# EAGLE design PBPJ1_CP (EAGLE 5.11)
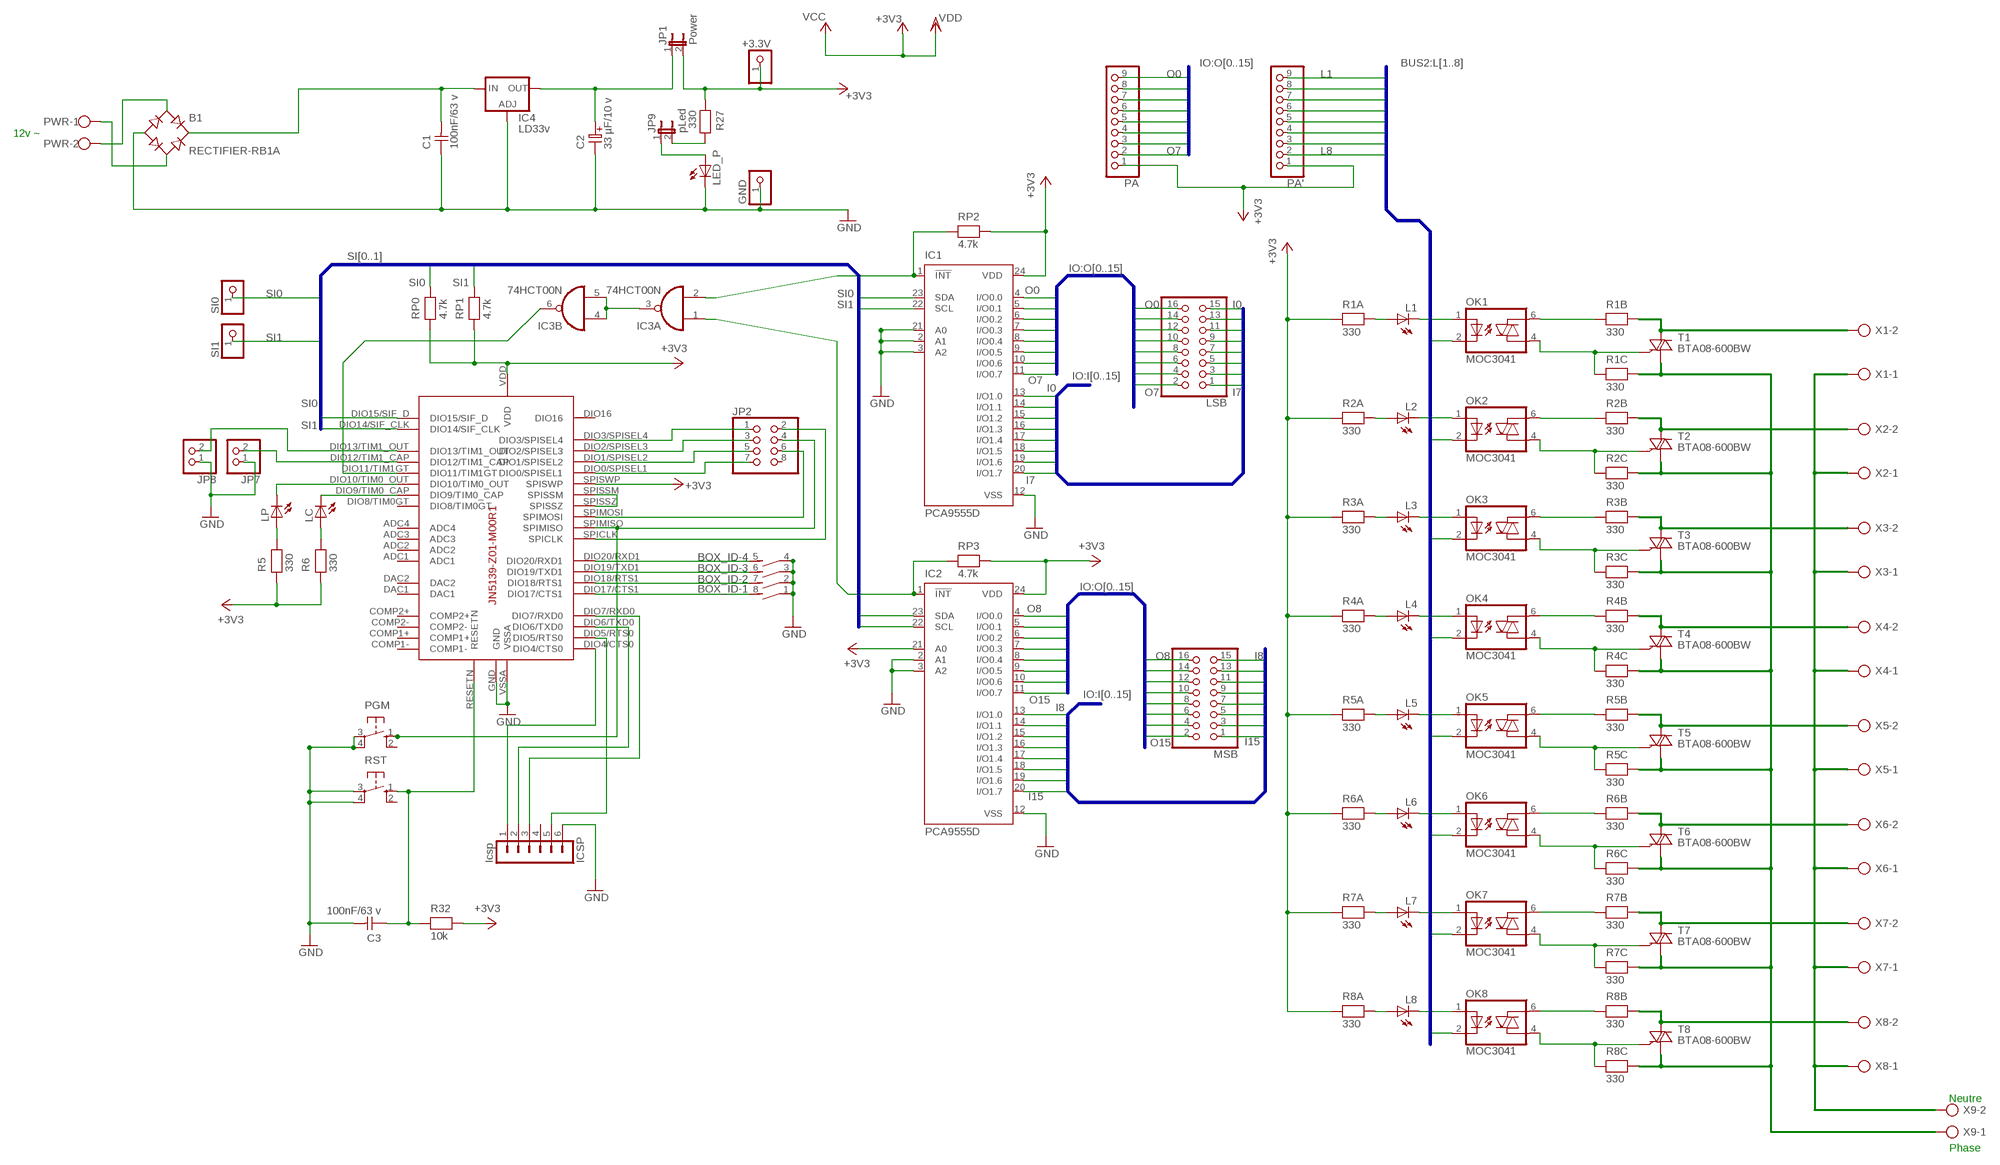
[diagram p0: schematic, sheet 1]

## Parts
+3.3V  PINHD-1X1  [1X01]
B1  RECTIFIER-RB1A  [RB1A]
BOX_ID  DIP04S  [DIP04S]
C1  100nF/63 v  CAPNP-5  [C-5]
C2  33 µF/10 v  ELC-2,5L  [ES-2,5L]
C3  100nF/63 v  CAPNP-5  [C-5]
GND  PINHD-1X1  [1X01]
IC1  PCA9555D  [SO24]
IC2  PCA9555D  [SO24]
IC3  74HCT00N  [DIL14]
IC4  LD33v  LM317TS  [317TS]
ICSP  Icsp  MA06-1  [MA06-1]
JP1  Power  JP1E  [JP1]
JP2  PINHD-2X4  [2X04]
JP7  PINHD-1X2  [1X02]
JP8  PINHD-1X2  [1X02]
JP9  pLed  JP1E  [JP1]
L1  LED3MM  [LED3MM]
L2  LED3MM  [LED3MM]
L3  LED3MM  [LED3MM]
L4  LED3MM  [LED3MM]
L5  LED3MM  [LED3MM]
L6  LED3MM  [LED3MM]
L7  LED3MM  [LED3MM]
L8  LED3MM  [LED3MM]
LC  LED3MM  [LED3MM]
LED_P  LED3MM  [LED3MM]
LP  LED3MM  [LED3MM]
LSB  PINHD-2X8  [2X08]
MSB  PINHD-2X8  [2X08]
OK1  MOC3041  IL420  [DIL06]
OK2  MOC3041  IL420  [DIL06]
OK3  MOC3041  IL420  [DIL06]
OK4  MOC3041  IL420  [DIL06]
OK5  MOC3041  IL420  [DIL06]
OK6  MOC3041  IL420  [DIL06]
OK7  MOC3041  IL420  [DIL06]
OK8  MOC3041  IL420  [DIL06]
PA  PINHD-1X9  [1X09]
PA'  PINHD-1X9  [1X09]
PGM  10-XX  [B3F-10XX]
PWR  AK550/2  [AK550/2]
R1A  330  RESEU-7,5  [R-7,5]
R1B  330  RESEU-7,5  [R-7,5]
R1C  330  RESEU-7,5  [R-7,5]
R2A  330  RESEU-7,5  [R-7,5]
R2B  330  RESEU-7,5  [R-7,5]
R2C  330  RESEU-7,5  [R-7,5]
R3A  330  RESEU-7,5  [R-7,5]
R3B  330  RESEU-7,5  [R-7,5]
R3C  330  RESEU-7,5  [R-7,5]
R4A  330  RESEU-7,5  [R-7,5]
R4B  330  RESEU-7,5  [R-7,5]
R4C  330  RESEU-7,5  [R-7,5]
R5  330  RESEU-7,5  [R-7,5]
R5A  330  RESEU-7,5  [R-7,5]
R5B  330  RESEU-7,5  [R-7,5]
R5C  330  RESEU-7,5  [R-7,5]
R6  330  RESEU-7,5  [R-7,5]
R6A  330  RESEU-7,5  [R-7,5]
R6B  330  RESEU-7,5  [R-7,5]
R6C  330  RESEU-7,5  [R-7,5]
R7A  330  RESEU-7,5  [R-7,5]
R7B  330  RESEU-7,5  [R-7,5]
R7C  330  RESEU-7,5  [R-7,5]
R8A  330  RESEU-7,5  [R-7,5]
R8B  330  RESEU-7,5  [R-7,5]
R8C  330  RESEU-7,5  [R-7,5]
R27  330  RESEU-7,5  [R-7,5]
R32  10k  RESEU-7,5  [R-7,5]
RP0  4.7k  RESEU-7,5  [R-7,5]
RP1  4.7k  RESEU-7,5  [R-7,5]
RP2  4.7k  RESEU-7,5  [R-7,5]
RP3  4.7k  RESEU-7,5  [R-7,5]
RST  10-XX  [B3F-10XX]
SI0  PINHD-1X1  [1X01]
SI1  PINHD-1X1  [1X01]
T1  BTA08-600BW  TIC225S  [TO220DS]
T2  BTA08-600BW  TIC225S  [TO220DS]
T3  BTA08-600BW  TIC225S  [TO220DS]
T4  BTA08-600BW  TIC225S  [TO220DS]
T5  BTA08-600BW  TIC225S  [TO220DS]
T6  BTA08-600BW  TIC225S  [TO220DS]
T7  BTA08-600BW  TIC225S  [TO220DS]
T8  BTA08-600BW  TIC225S  [TO220DS]
U1  JN5139-Z01-M00R1  [JENNIC5139MODULE]
X1  AK500/2  [AK500/2]
X2  AK500/2  [AK500/2]
X3  AK500/2  [AK500/2]
X4  AK500/2  [AK500/2]
X5  AK500/2  [AK500/2]
X6  AK500/2  [AK500/2]
X7  AK500/2  [AK500/2]
X8  AK500/2  [AK500/2]
X9  AK500/2  [AK500/2]

## Nets
+3V3: +3.3V.1 IC1.24(VDD) IC2.21(A0) IC2.24(VDD) JP1.2 PA'.1 PA.1 R1A.1 R2A.1 R3A.1 R4A.1 R5.1 R5A.1 R6.1 R6A.1 R7A.1 R8A.1 R27.1 R32.2 RP0.1 RP1.1 RP2.2 RP3.2 U1.SPISWP U1.VDD ; supply symbol labelled VDD, VCC
GND: B1.- BOX_ID.1 BOX_ID.2 BOX_ID.3 BOX_ID.4 C1.1 C2.2 C3.2 GND.1 IC1.2(A1) IC1.3(A2) IC1.12(VSS) IC1.21(A0) IC2.2(A1) IC2.3(A2) IC2.12(VSS) IC4.1(ADJ) ICSP.6 JP7.1 JP8.1 LED_P.K(C) PGM.3(P) PGM.4(P1) RST.3(P) RST.4(P1) U1.GND U1.VSSA
I0: IC1.13(I/O1.0) LSB.15
I1: IC1.14(I/O1.1) LSB.13
I2: IC1.15(I/O1.2) LSB.11
I3: IC1.16(I/O1.3) LSB.9
I4: IC1.17(I/O1.4) LSB.7
I5: IC1.18(I/O1.5) LSB.5
I6: IC1.19(I/O1.6) LSB.3
I7: IC1.20(I/O1.7) LSB.1
I8: IC2.13(I/O1.0) MSB.15
I9: IC2.14(I/O1.1) MSB.13
I10: IC2.15(I/O1.2) MSB.11
I11: IC2.16(I/O1.3) MSB.9
I12: IC2.17(I/O1.4) MSB.7
I13: IC2.18(I/O1.5) MSB.5
I14: IC2.19(I/O1.6) MSB.3
I15: IC2.20(I/O1.7) MSB.1
L1: OK1.2(C) PA'.9
L2: OK2.2(C) PA'.8
L3: OK3.2(C) PA'.7
L4: OK4.2(C) PA'.6
L5: OK5.2(C) PA'.5
L6: OK6.2(C) PA'.4
L7: OK7.2(C) PA'.3
L8: OK8.2(C) PA'.2
N$1: L4.K(C) OK4.1(A)
N$2: C2.1 IC4.2(OUT) JP1.1
N$3: B1.+ C1.2 IC4.3(IN)
N$4: B1.AC1 PWR.2
N$5: B1.AC2 PWR.1
N$6: OK2.4(A1) R2C.1 T2.G
N$7: C3.1 R32.1 RST.1(S) U1.RESETN
N$8: OK1.4(A1) R1C.1 T1.G
N$9: L3.K(C) OK3.1(A)
N$10: OK3.4(A1) R3C.1 T3.G
N$11: U1.SPISSM U1.SPISSZ
N$12: OK4.4(A1) R4C.1 T4.G
N$13: L1.K(C) OK1.1(A)
N$14: JP2.1 U1.DIO3/SPISEL4
N$15: OK5.4(A1) R5C.1 T5.G
N$16: JP2.3 U1.DIO2/SPISEL3
N$17: L2.K(C) OK2.1(A)
N$18: OK6.4(A1) R6C.1 T6.G
N$19: JP2.5 U1.DIO1/SPISEL2
N$20: JP2.7 U1.DIO0/SPISEL1
N$21: OK7.4(A1) R7C.1 T7.G
N$22: L5.K(C) OK5.1(A)
N$23: JP2.6 U1.SPIMOSI
N$24: OK8.4(A1) R8C.1 T8.G
N$25: OK1.6(A2) R1B.1
N$26: OK2.6(A2) R2B.1
N$27: L6.K(C) OK6.1(A)
N$28: JP2.2 U1.SPICLK
N$30: OK3.6(A2) R3B.1
N$31: OK4.6(A2) R4B.1
N$32: L7.K(C) OK7.1(A)
N$33: OK5.6(A2) R5B.1
N$34: OK6.6(A2) R6B.1
N$35: OK7.6(A2) R7B.1
N$36: OK8.6(A2) R8B.1
N$37: L8.K(C) OK8.1(A)
N$45: IC3.3(A:O) IC3.4(B:I0) IC3.5(B:I1)
N$46: IC1.1(!INT) IC3.2(A:I1) RP2.1
N$47: JP9.2 R27.2
N$48: IC2.1(!INT) IC3.1(A:I0) RP3.1
N$49: IC3.6(B:O) U1.DIO11/TIM1GT
N$53: L2.A R2A.2
N$54: L3.A R3A.2
N$55: L4.A R4A.2
N$56: L5.A R5A.2
N$57: L6.A R6A.2
N$58: L7.A R7A.2
N$59: L8.A R8A.2
N$60: L1.A R1A.2
N$62: BOX_ID.5 U1.DIO20/RXD1
N$65: JP9.1 LED_P.A
N$67: ICSP.2 U1.DIO6/TXD0
N$70: JP2.4 PGM.1(S) U1.SPIMISO
N$73: ICSP.1 U1.DIO4/CTS0
N$74: ICSP.5 U1.DIO5/RTS0
N$77: ICSP.3 U1.DIO7/RXD0
N$78 [AC_VOLTAGE]: R1B.2 T1.A2 X1.2
N$79 [AC_VOLTAGE]: R2B.2 T2.A2 X2.2
N$80 [AC_VOLTAGE]: R3B.2 T3.A2 X3.2
N$81 [AC_VOLTAGE]: R4B.2 T4.A2 X4.2
N$82 [AC_VOLTAGE]: R5B.2 T5.A2 X5.2
N$83 [AC_VOLTAGE]: R6B.2 T6.A2 X6.2
N$84: R7B.2 T7.A2 X7.2
N$92: BOX_ID.6 U1.DIO19/TXD1
N$93: R8B.2 T8.A2 X8.2
N$94: BOX_ID.7 U1.DIO18/RTS1
N$95: BOX_ID.8 U1.DIO17/CTS1
N$96: JP7.2 U1.DIO12/TIM1_CAP
N$97: LP.A R5.2
N$98: JP8.2 U1.DIO13/TIM1_OUT
N$100: LP.K(C) U1.DIO10/TIM0_OUT
N$101: LC.A R6.2
N$103: LC.K(C) U1.DIO9/TIM0_CAP
NEUTRE [AC_VOLTAGE]: X1.1 X2.1 X3.1 X4.1 X5.1 X6.1 X7.1 X8.1 X9.2
O0: IC1.4(I/O0.0) LSB.16 PA.9
O1: IC1.5(I/O0.1) LSB.14 PA.8
O2: IC1.6(I/O0.2) LSB.12 PA.7
O3: IC1.7(I/O0.3) LSB.10 PA.6
O4: IC1.8(I/O0.4) LSB.8 PA.5
O5: IC1.9(I/O0.5) LSB.6 PA.4
O6: IC1.10(I/O0.6) LSB.4 PA.3
O7: IC1.11(I/O0.7) LSB.2 PA.2
O8: IC2.4(I/O0.0) MSB.16
O9: IC2.5(I/O0.1) MSB.14
O10: IC2.6(I/O0.2) MSB.12
O11: IC2.7(I/O0.3) MSB.10
O12: IC2.8(I/O0.4) MSB.8
O13: IC2.9(I/O0.5) MSB.6
O14: IC2.10(I/O0.6) MSB.4
O15: IC2.11(I/O0.7) MSB.2
PHASE [AC_VOLTAGE]: R1C.2 R2C.2 R3C.2 R4C.2 R5C.2 R6C.2 R7C.2 R8C.2 T1.A1 T2.A1 T3.A1 T4.A1 T5.A1 T6.A1 T7.A1 T8.A1 X9.1
SI0: IC1.23(SDA) IC2.23(SDA) RP0.2 SI0.1 U1.DIO15/SIF_D
SI1: IC1.22(SCL) IC2.22(SCL) RP1.2 SI1.1 U1.DIO14/SIF_CLK
Unconnected: IC3.8(C:O) IC3.9(C:I0) IC3.10(C:I1) IC3.11(D:O) IC3.12(D:I0) IC3.13(D:I1) ICSP.4 JP2.8 PGM.2(S1) RST.2(S1) U1.ADC1 U1.ADC2 U1.ADC3 U1.ADC4 U1.COMP1+ U1.COMP1- U1.COMP2+ U1.COMP2- U1.DAC1 U1.DAC2 U1.DIO8/TIM0GT U1.DIO16

## Buses
SI[0..1]
BUS2:L[1..8]
IO:I[0..15]
IO:O[0..15]

## Notes on the sheet
- 12v ~
- Neutre
- Phase

## Power pins joined to a net without a drawn wire
GND: IC3.7(P:GND)
VCC: IC3.14(P:VCC)

## Library data of the parts
+3.3V GND SI0 SI1 = pinhead:PINHD-1X1: PIN HEADER
B1 = rectifier:RECTIFIER-: Rectifier
BOX_ID = switch-dil:DIP04S: DIL/CODE SWITCH; OC_FARNELL: unknown; OC_NEWARK: unknown
C1 C3 = discrete:CAPNP-5
C2 = discrete:ELC-2,5L
IC1 IC2 = micro-philips:PCA9555: 16-bit I2C and SMBus I/O port with interrupt Source: PCA9555_5.pdf; MPN: PCA9555DW; OC_FARNELL: 1408295; OC_NEWARK: 63K6067
IC3 = 74xx-eu:74*00: Quad 2-input NAND gate
IC4 = v-reg:LM317TS: VOLTAGE REGULATOR
ICSP = con-lstb:MA06-1: PIN HEADER; OC_FARNELL: unknown; OC_NEWARK: unknown
JP1 JP9 = jumper:JP1E: JUMPER
JP2 = pinhead:PINHD-2X4: PIN HEADER
JP7 JP8 = pinhead:PINHD-1X2: PIN HEADER
L1-L8 LC LED_P LP = led:LED: LED OSRAM: - CHIPLED LG R971, LG N971, LY N971, LG Q971, LY Q971, LO R971, LY R971 LH N974, LH R974 LS Q976, LO Q976, LY Q976 LO Q996 - Hyper CHIPLED LW Q18S LB Q993, LB Q99A, LB R99A - SideLED LS A670, LO A670, LY A670, LG A670, LP A670 LB A673, LV A673, LT A673, LW A673 LH A674 LY A675 LS A676, LA A676, LO A676, LY A676, LW A676 LS A679, LY A679, LG A679 - Hyper Micro SIDELED® LS Y876, LA Y876, LO Y876, LY Y876 LT Y87S - SmartLED LW L88C, LW L88S LB L89C, LB L89S, LG L890 LS L89K, LO L89K, LY L89K LS L896, LA L896, LO L896, LY L896 - TOPLED LS T670, LO T670, LY T670, LG T670, LP T670 LSG T670, LSP T670, LSY T670, LOP T670, LYG T670 LG T671, LOG T671, LSG T671 LB T673, LV T673, LT T673, LW T673 LH T674 LS T676, LA T676, LO T676, LY T676, LB T676, LH T676, LSB T676, LW T676 LB T67C, LV T67C, LT T67C, LS T67K, LO T67K, LY T67K, LW E67C LS E67B, LA E67B, LO E67B, LY E67B, LB E67C, LV E67C, LT E67C LW T67C LS T679, LY T679, LG T679 LS T770, LO T770, LY T770, LG T770, LP T770 LB T773, LV T773, LT T773, LW T773 LH T774 LS E675, LA E675, LY E675, LS T675 LS T776, LA T776, LO T776, LY T776, LB T776 LHGB T686 LT T68C, LB T68C - Hyper Mini TOPLED® LB M676 - Mini TOPLED Santana® LG M470 LS M47K, LO M47K, LY M47K Source: http://www.osram.convergy.de LUXEON: - LUMILED® LXK2-PW12-R00, LXK2-PW12-S00, LXK2-PW14-U00, LXK2-PW14-V00 LXK2-PM12-R00, LXK2-PM12-S00, LXK2-PM14-U00 LXK2-PE12-Q00, LXK2-PE12-R00, LXK2-PE12-S00, LXK2-PE14-T00, LXK2-PE14-U00 LXK2-PB12-K00, LXK2-PB12-L00, LXK2-PB12-M00, LXK2-PB14-N00, LXK2-PB14-P00, LXK2-PB14-Q00 LXK2-PR12-L00, LXK2-PR12-M00, LXK2-PR14-Q00, LXK2-PR14-R00 LXK2-PD12-Q00, LXK2-PD12-R00, LXK2-PD12-S00 LXK2-PH12-R00, LXK2-PH12-S00 LXK2-PL12-P00, LXK2-PL12-Q00, LXK2-PL12-R00 Source: www.luxeon.com KINGBRIGHT: KA-3528ASYC Source: www.kingbright.com
LSB MSB = pinhead:PINHD-2X8: PIN HEADER
OK1-OK8 = optocoupler:IL420: SIEMENS OPTO COUPLER
PA PA' = pinhead:PINHD-1X9: PIN HEADER
PGM RST = switch-omron:10-XX: OMRON SWITCH; MPN: B3F-1000; OC_FARNELL: 176432; OC_NEWARK: 36M3542
PWR = con-ptr500+:AK550/2: CONNECTOR
R1A R1B R1C R2A R2B R2C R3A R3B R3C R4A R4B R4C R5 R5A R5B R5C R6 R6A R6B R6C R7A R7B R7C R8A R8B R8C R27 R32 RP0 RP1-RP3 = discrete:RESEU-7,5
T1-T8 = triac:TIC225S: TRIAC
U1 = jennic:JN5139-Z01-M00R1: Jennic 5139 Zigbee Module
X1-X9 = con-ptr500:AK500/2: CONNECTOR; OC_FARNELL: unknown; OC_NEWARK: unknown

## Net classes
0 default: width 0.254 mm, drill 0.6 mm, clearance 0.254 mm
1 AC_VOLTAGE: width 0.254 mm, drill 0.6 mm, clearance 0.254 mm
2 AC_TERRE: width 1.422 mm, clearance 0.254 mm

## Board
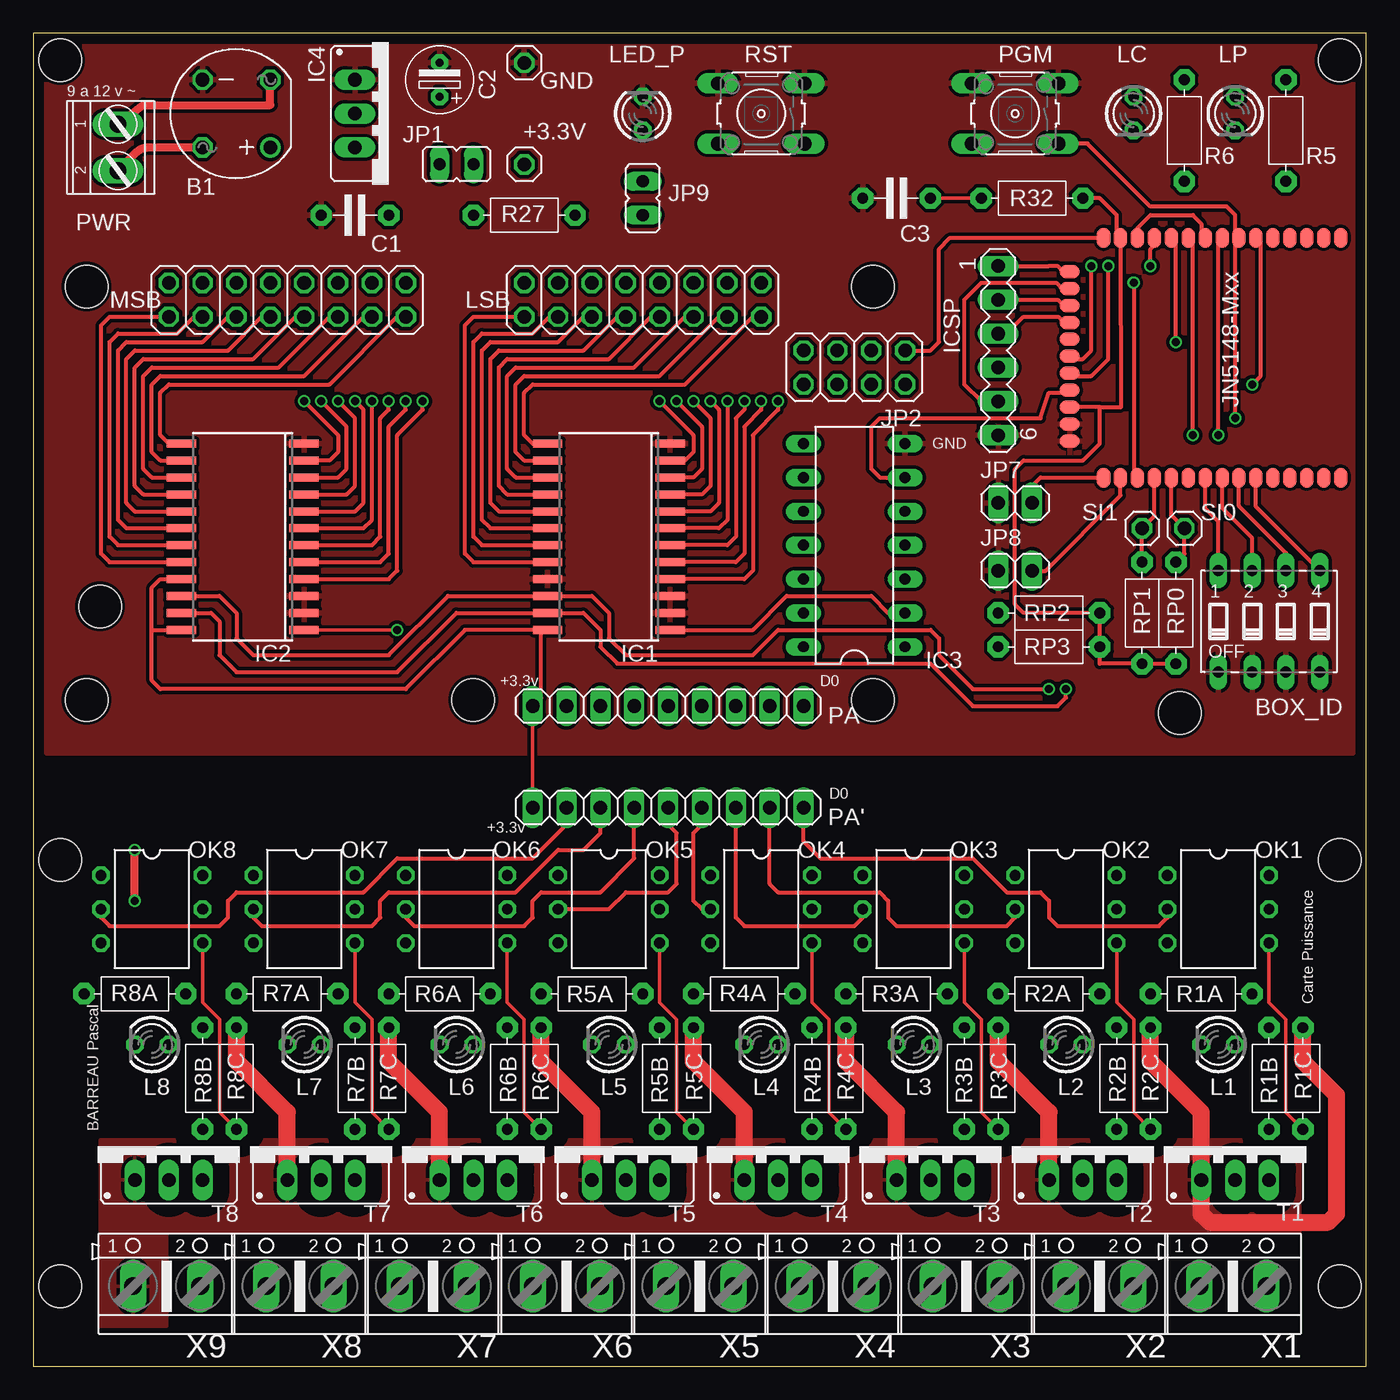
[diagram p1: board, top side]
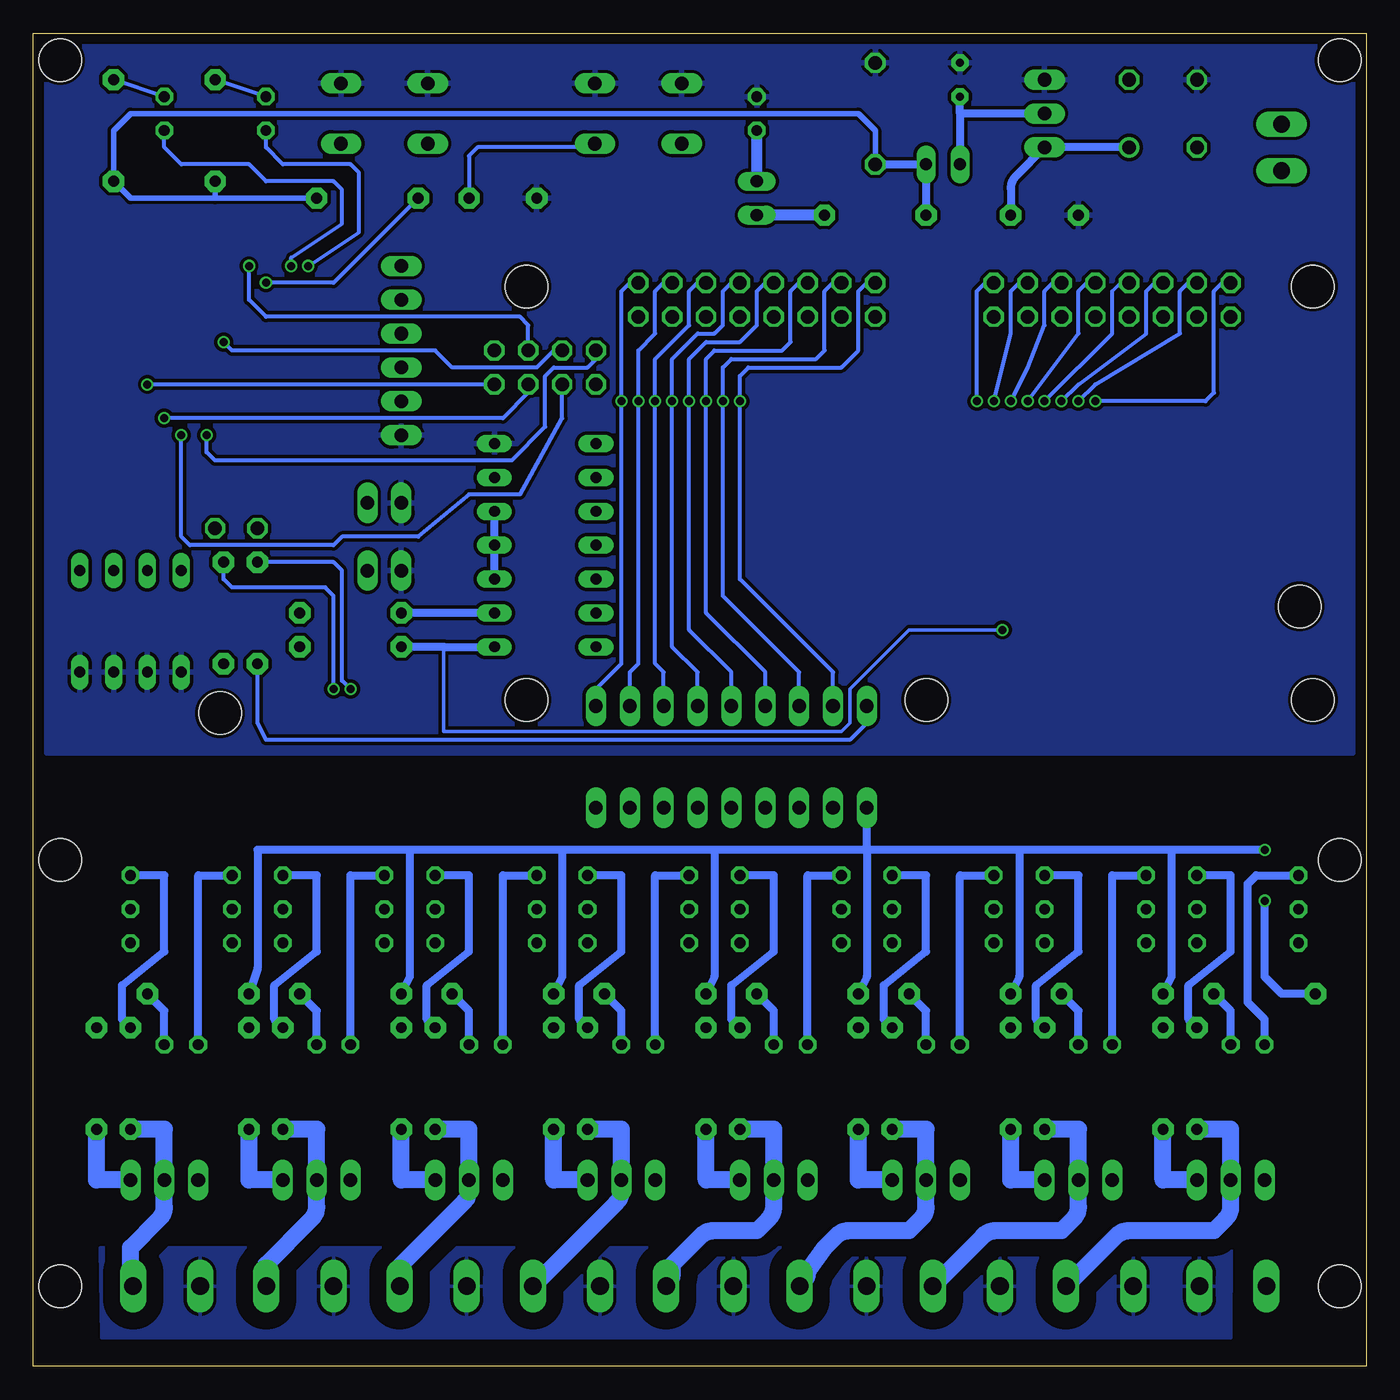
[diagram p2: board, bottom side, seen from below]

Size 100 x 100 mm. Coordinates in mm from the lower left corner, seen from the top.
Outline: 0,0 100,0 100,100 0,100 0,0
Copper layers (1*16): Top 0.035mm / dielectric 1.5mm / Bottom 0.035mm
Design rules "ElecFreaks_CAM_DRC_V1.0": minimum track width 6mil, minimum drill 12mil, track to track 6mil, track to pad 6mil, pad to pad 6mil, via to via 6mil, smd to smd 0mil, copper to edge 10mil, drill to drill 10mil, minimum pad ring 10mil, minimum via ring 6mil, stop-mask expansion 2mil, vias tented up to drill 100mil, thermal gap 10mil
Holes 3.2 mm at 63,50 86,49 4,50 98,6 2,6 2,98 98,98 4,81 63,81 98,38 2,38 5,57 33,50

### Footprints (pad centres in the part's own frame; a part is rotated, then mirrored left to right if it is on the bottom)
1X01 = drill 1.016 octagon: 1 0,0
RB1A = drill 1.016 round: + -2.54,2.54 | drill 1.016 octagon: - 2.54,-2.54; AC1 2.54,2.54; AC2 -2.54,-2.54
DIP04S = drill 0.813 long: 1 -3.81,-3.81; 2 -1.27,-3.81; 3 1.27,-3.81; 4 3.81,-3.81; 5 3.81,3.81; 6 1.27,3.81; 7 -1.27,3.81; 8 -3.81,3.81
C-5 = drill 0.813 pad 1.6 octagon: 1 -2.54,0; 2 2.54,0
ES-2,5L = drill 0.61 pad 1.27 octagon: 1 0,0; 2 2.54,0
SO24 = smd 0.6 x 2.2: 1 -6.985,-4.6; 2 -5.715,-4.6; 3 -4.445,-4.6; 4 -3.175,-4.6; 5 -1.905,-4.6; 6 -0.635,-4.6; 7 0.635,-4.6; 8 1.905,-4.6; 9 3.175,-4.6; 10 4.445,-4.6; 11 5.715,-4.6; 12 6.985,-4.6; 13 6.985,4.6; 14 5.715,4.6; 15 4.445,4.6; 16 3.175,4.6; 17 1.905,4.6; 18 0.635,4.6; 19 -0.635,4.6; 20 -1.905,4.6; 21 -3.175,4.6; 22 -4.445,4.6; 23 -5.715,4.6; 24 -6.985,4.6
DIL14 = drill 0.813 long: 1 -7.62,-3.81; 2 -5.08,-3.81; 3 -2.54,-3.81; 4 0,-3.81; 5 2.54,-3.81; 6 5.08,-3.81; 7 7.62,-3.81; 8 7.62,3.81; 9 5.08,3.81; 10 2.54,3.81; 11 0,3.81; 12 -2.54,3.81; 13 -5.08,3.81; 14 -7.62,3.81
317TS = drill 1.016 long: 1 -2.54,-2.54; 2 0,-2.54; 3 2.54,-2.54
MA06-1 = drill 1.016 long: 1 -6.35,0; 2 -3.81,0; 3 -1.27,0; 4 1.27,0; 5 3.81,0; 6 6.35,0
JP1 = drill 0.914 long: 1 0,-1.27; 2 0,1.27
2X04 = drill 1.016 octagon: 1 -3.81,-1.27; 2 -3.81,1.27; 3 -1.27,-1.27; 4 -1.27,1.27; 5 1.27,-1.27; 6 1.27,1.27; 7 3.81,-1.27; 8 3.81,1.27
1X02 = drill 1.016 long: 1 -1.27,0; 2 1.27,0
LED3MM = drill 0.813 octagon: A -1.27,0; K 1.27,0
2X08 = drill 1.016 octagon: 1 -8.89,-1.27; 2 -8.89,1.27; 3 -6.35,-1.27; 4 -6.35,1.27; 5 -3.81,-1.27; 6 -3.81,1.27; 7 -1.27,-1.27; 8 -1.27,1.27; 9 1.27,-1.27; 10 1.27,1.27; 11 3.81,-1.27; 12 3.81,1.27; 13 6.35,-1.27; 14 6.35,1.27; 15 8.89,-1.27; 16 8.89,1.27
DIL06 = drill 0.813 octagon: 1 -2.54,-3.81; 2 0,-3.81; 3 2.54,-3.81; 4 2.54,3.81; 5 0,3.81; 6 -2.54,3.81
1X09 = drill 1.016 long: 1 -10.16,0; 2 -7.62,0; 3 -5.08,0; 4 -2.54,0; 5 0,0; 6 2.54,0; 7 5.08,0; 8 7.62,0; 9 10.16,0
B3F-10XX = drill 1.016 long: 1 -3.251,2.261; 2 3.251,2.261; 3 -3.251,-2.261; 4 3.251,-2.261
AK550/2 = drill 1.27 long: 1 -1.75,0; 2 1.75,0
R-7,5 = drill 0.813 pad 1.6 octagon: 1 -3.81,0; 2 3.81,0
TO220DS = drill 1.016 long: A1 -2.54,-2.54; A2 0,-2.54; G 2.54,-2.54
JENNIC5139MODULE = smd 1.5 x 1: ADC1 18,17.78; ADC2 18,19.05; ADC3 18,20.32; ADC4 0,20.32; COMP1+ 18,16.51; COMP1- 18,15.24; COMP2+ 0,16.51; COMP2- 0,15.24; DAC1 0,19.05; DAC2 0,17.78; DIO0/SPISEL1 0,8.89; DIO1/SPISEL2 0,7.62; DIO2/SPISEL3 0,6.35; DIO3/SPISEL4 0,2.54; DIO12/TIM1_CAP 18,2.54; DIO13/TIM1_OUT 18,3.81; DIO14/SIF_CLK 18,6.35; DIO15/SIF_D 18,7.62; DIO16 18,8.89; DIO17/CTS1 18,10.16; DIO18/RTS1 18,11.43; DIO19/TXD1 18,12.7; DIO20/RXD1 18,13.97; RESETN 18,5.08; SPICLK 0,13.97; SPIMISO 0,12.7; SPIMOSI 0,11.43; SPISSM 0,5.08; SPISSZ 0,10.16; SPISWP 0,3.81 | smd 1 x 1.5: DIO4/CTS0 2.54,0; DIO5/RTS0 3.81,0; DIO6/TXD0 5.08,0; DIO7/RXD0 6.35,0; DIO8/TIM0GT 7.62,0; DIO9/TIM0_CAP 8.89,0; DIO10/TIM0_OUT 10.16,0; DIO11/TIM1GT 11.43,0; GND 13.97,0; VDD 12.7,0; VSSA 15.24,0
AK500/2 = drill 1.321 long: 1 -2.515,0; 2 2.515,0

### Placement (x,y rotation side)
+3.3V  36.83,90.17 0 top
B1  15.24,93.98 180 top
BOX_ID  92.71,55.88 0 top
C1  24.13,86.36 0 top
C2  30.48,95.25 90 top
C3  64.77,87.63 180 top
GND  36.83,97.79 0 top
IC1  43.18,62.23 90 top
IC2  15.7,62.23 90 top
IC3  61.59,61.59 90 top
IC4  26.67,93.98 270 top
ICSP  72.39,76.2 270 top
JP1  31.75,90.17 270 top
JP2  61.59,74.93 180 top
JP7  73.66,64.77 0 top
JP8  73.66,59.69 0 top
JP9  45.72,87.63 180 top
L1  88.9,24.13 180 top
L2  77.47,24.13 180 top
L3  66.04,24.13 180 top
L4  54.61,24.13 180 top
L5  43.18,24.13 180 top
L6  31.75,24.13 180 top
L7  20.32,24.13 180 top
L8  8.89,24.13 180 top
LC  82.55,93.98 270 top
LED_P  45.72,93.98 90 top
LP  90.17,93.98 270 top
LSB  45.72,80.01 0 top
MSB  19.05,80.01 0 top
OK1  88.9,34.29 270 top
OK2  77.47,34.29 270 top
OK3  66.04,34.29 270 top
OK4  54.61,34.29 270 top
OK5  43.18,34.29 270 top
OK6  31.75,34.29 270 top
OK7  20.32,34.29 270 top
OK8  8.89,34.29 270 top
PA  47.62,49.53 0 top
PA'  47.62,41.91 0 top
PGM  73.66,93.98 180 top
PWR  6.35,91.44 270 top
R1A  87.63,27.94 0 top
R1B  92.71,21.59 270 top
R1C  95.25,21.59 90 top
R2A  76.2,27.94 0 top
R2B  81.28,21.59 270 top
R2C  83.82,21.59 90 top
R3A  64.77,27.94 0 top
R3B  69.85,21.59 270 top
R3C  72.39,21.59 90 top
R4A  53.34,27.94 0 top
R4B  58.42,21.59 270 top
R4C  60.96,21.59 90 top
R5  93.98,92.71 90 top
R5A  41.91,27.94 0 top
R5B  46.99,21.59 270 top
R5C  49.53,21.59 90 top
R6  86.36,92.71 90 top
R6A  30.48,27.94 0 top
R6B  35.56,21.59 270 top
R6C  38.1,21.59 90 top
R7A  19.05,27.94 0 top
R7B  24.13,21.59 270 top
R7C  26.67,21.59 90 top
R8A  7.62,27.94 0 top
R8B  12.7,21.59 270 top
R8C  15.24,21.59 90 top
R27  36.83,86.36 0 top
R32  74.93,87.63 0 top
RP0  85.72,56.52 90 top
RP1  83.19,56.52 90 top
RP2  76.2,56.52 0 top
RP3  76.2,53.98 0 top
RST  54.61,93.98 180 top
SI0  86.36,62.87 0 top
SI1  83.19,62.87 0 top
T1  90.17,16.51 0 top
T2  78.74,16.51 0 top
T3  67.31,16.51 0 top
T4  55.88,16.51 0 top
T5  44.45,16.51 0 top
T6  33.02,16.51 0 top
T7  21.59,16.51 0 top
T8  10.16,16.51 0 top
U1  77.76,84.66 270 top
X1  90,6 0 top
X2  80,6 0 top
X3  70,6 0 top
X4  60,6 0 top
X5  50,6 0 top
X6  40,6 0 top
X7  30,6 0 top
X8  20,6 0 top
X9  10,6 0 top

### Tracks (layer width: path | path; a pad name or v marks a point on that pad's centre or on a via)
+3V3  (via drill 0.6)
  Top 0.254: PA'.1 PA.1 | 81.92,84.45 U1.SPISWP
  Top 0.305: 38.1,55.24 32.38,55.24 27.94,50.8 9.53,50.8 8.89,51.44 8.89,55.24 | IC2.21 9.53,59.05 8.89,58.42 8.89,55.24 | 8.89,55.24 IC2.24 | RP0.1 RP1.1 80.01,52.7 RP3.2 RP2.2 74.3,56.52 73.66,57.15 73.66,67.31 74.3,67.94 78.74,67.94 80.01,69.22 80.01,71.96 | PA.1 38.1,50.16 38.1,55.24 | 38.1,55.24 IC1.24 | R32.2 80.01,87.63 81.28,86.36 81.28,84.95 U1.SPISWP | 81.92,84.45 81.83,84.45 81.6,84.23 81.61,84.23 81.62,71.96 80.01,71.96 | 80.01,71.96 U1.VDD | 80.01,71.96
  Top 0.61: v7.62,34.92 v7.62,38.73
  Bottom 0.305: PA.1 37.47,48.26 38.73,46.99 82.55,46.99 83.19,48.26 RP1.1
  Bottom 0.406: JP1.2 33.02,88.9 | +3.3V.1 36.83,92.71 38.1,93.98 92.71,93.98 93.98,92.71 R5.1 92.71,87.63 86.36,87.63 | R32.2 86.36,87.63 | 86.36,87.63 R6.1
  Bottom 0.61: +3.3V.1 JP1.2 | R1A.1 83.19,29.84 83.19,38.73 71.75,38.73 | R2A.1 71.75,29.21 71.75,38.73 | R6A.1 26.04,29.21 26.04,38.73 | R5A.1 37.47,29.21 37.47,38.73 | R4A.1 48.9,29.21 48.9,38.73 | R3A.1 60.33,29.21 60.33,38.73 | R7A.1 14.61,29.21 14.61,38.73 | 33.02,88.9 R27.1 | 60.33,38.73 71.75,38.73 | 48.9,38.73 60.33,38.73 | 37.47,38.73 48.9,38.73 | 26.04,38.73 37.47,38.73 | 14.61,38.73 26.04,38.73 | R8A.1 6.35,27.94 7.62,29.21 v7.62,34.92 | v7.62,38.73 14.61,38.73 | 37.47,38.73 PA'.1
GND
  pour Bottom: 1,99 1,46 99,46 99,99
  pour Top (isolate 0.254): 1,99 99,99 99,46 1,46
I0
  Top 0.254: IC1.13 38.1,69.22
  Top 0.305: IC1.13 37.47,69.22 36.83,69.85 36.83,73.03 37.47,73.66 48.9,73.66 53.98,78.74 LSB.15
I1
  Top 0.305: IC1.14 36.83,67.94 36.2,68.58 36.2,73.66 36.83,74.3 46.99,74.3 51.44,78.74 LSB.13
I2
  Top 0.305: IC1.15 36.2,66.67 35.56,67.31 35.56,74.3 36.2,74.93 45.09,74.93 48.9,78.74 LSB.11
I3
  Top 0.305: IC1.16 35.56,65.41 34.92,66.04 34.92,74.93 35.56,75.56 43.18,75.56 46.35,78.74 LSB.9
I4
  Top 0.305: IC1.17 34.92,64.14 34.29,64.77 34.29,75.56 34.92,76.2 41.27,76.2 43.81,78.74 LSB.7
I5
  Top 0.305: IC1.18 34.29,62.87 33.66,63.5 33.66,76.2 34.29,76.83 39.37,76.83 41.27,78.74 LSB.5
I6
  Top 0.305: IC1.19 33.66,61.59 33.02,62.23 33.02,76.83 33.66,77.47 37.47,77.47 38.73,78.74 LSB.3
I7
  Top 0.305: IC1.20 33.02,60.33 32.38,60.96 32.38,78.11 33.02,78.74 LSB.1
I8
  Top 0.305: IC2.13 10.16,69.22 9.53,69.85 9.53,73.03 10.16,73.66 22.23,73.66 27.3,78.74 MSB.15
I9
  Top 0.305: IC2.14 9.53,67.94 8.89,68.58 8.89,73.66 9.53,74.3 20.32,74.3 24.77,78.74 MSB.13
I10
  Top 0.305: IC2.15 8.89,66.67 8.26,67.31 8.26,74.3 8.89,74.93 18.41,74.93 22.23,78.74 MSB.11
I11
  Top 0.305: IC2.16 8.26,65.41 7.62,66.04 7.62,74.93 8.26,75.56 16.51,75.56 19.68,78.74 MSB.9
I12
  Top 0.305: IC2.17 7.62,64.14 6.99,64.77 6.99,75.56 7.62,76.2 14.61,76.2 17.14,78.74 MSB.7
I13
  Top 0.305: IC2.18 6.99,62.87 6.35,63.5 6.35,76.2 6.99,76.83 12.7,76.83 14.61,78.74 MSB.5
I14
  Top 0.305: IC2.19 6.35,61.59 5.71,62.23 5.71,76.83 6.35,77.47 10.79,77.47 12.06,78.74 MSB.3
I15
  Top 0.305: IC2.20 5.71,60.33 5.08,60.96 5.08,78.11 5.71,78.74 MSB.1
L1
  Top 0.305: OK1.2 85.09,33.66 84.45,33.02 76.83,33.02 76.2,33.66 76.2,34.92 75.56,35.56 73.03,35.56 70.48,38.1 59.05,38.1 57.78,39.37 PA'.9
L2
  Top 0.305: OK2.2 73.66,33.66 73.03,33.02 64.77,33.02 64.14,33.66 64.14,34.92 63.5,35.56 55.88,35.56 55.24,36.2 PA'.8
L3
  Top 0.305: OK3.2 62.23,33.66 61.59,33.02 53.34,33.02 52.7,33.66 PA'.7
L4
  Top 0.305: PA'.6 50.16,40.64 49.53,40.01 49.53,34.92 50.16,34.29 OK4.2
L5
  Top 0.305: OK5.2 43.18,34.29 44.45,35.56 47.62,35.56 48.26,36.2 48.26,40.01 47.62,40.64 PA'.5
L6
  Top 0.305: OK6.2 27.94,33.66 28.57,33.02 36.83,33.02 37.47,33.66 37.47,34.92 38.1,35.56 42.55,35.56 45.09,38.1 PA'.4
L7
  Top 0.305: OK7.2 16.51,33.66 17.14,33.02 25.4,33.02 26.04,33.66 26.04,34.92 26.67,35.56 36.2,35.56 39.37,38.73 41.27,38.73 42.55,40.01 PA'.3
L8
  Top 0.305: OK8.2 5.08,33.66 5.71,33.02 13.97,33.02 14.61,33.66 14.61,34.92 15.24,35.56 24.77,35.56 27.3,38.1 37.47,38.1 40.01,40.64 PA'.2
N$1
  Bottom 0.61: L4.K 53.34,36.83 OK4.1
N$2
  Bottom 0.61: 30.48,93.98 JP1.1 | 30.48,93.98 C2.1 | IC4.2 30.48,93.98
N$3
  Bottom 0.61: B1.+ IC4.3 26.3,89.27 arc-45 26.67,88.37 C1.2
N$4
  Top 0.61: PWR.2 7.73,91.07 arc-45 8.63,91.44 B1.AC1
N$5
  Top 0.61: PWR.1 8.26,94.61 17.78,94.61 B1.AC2
N$6
  Top 0.254: OK2.4 81.28,27.3 82.55,26.04 82.55,19.05 R2C.1
  Bottom 1.27: T2.G 83.82,13.97 R2C.1
N$7  (via drill 0.6)
  Top 0.254: C3.1 R32.1
  Top 0.305: v82.55,81.28 82.55,66.95 U1.RESETN
  Bottom 0.305: C3.1 67.31,90.81 66.67,91.44 59.05,91.44 RST.1 | R32.1 77.47,81.28 v82.55,81.28
N$8
  Top 0.254: OK1.4 92.71,27.3 93.98,26.04 93.98,19.05 R1C.1
  Bottom 1.27: T1.G 95.25,13.97 R1C.1
N$9
  Bottom 0.61: L3.K 64.77,36.83 OK3.1
N$10
  Top 0.254: OK3.4 69.85,27.3 71.12,26.04 71.12,19.05 R3C.1
  Bottom 1.27: T3.G 72.39,13.97 R3C.1
N$11
  Top 0.305: U1.SPISSM 82.84,85.38 83.82,86.36 87,86.36 87.63,85.72 87.63,84.95 U1.SPISSZ
N$12
  Top 0.254: OK4.4 58.42,27.3 59.69,26.04 59.69,19.05 R4C.1
  Bottom 1.27: T4.G 60.96,13.97 R4C.1
N$13
  Bottom 0.61: L1.K 87.63,36.83 OK1.1
N$14
  Top 0.305: U1.DIO3/SPISEL4 68.78,84.66 67.94,83.82 67.94,76.83 67.31,76.2 JP2.1
N$15
  Top 0.254: OK5.4 46.99,27.3 48.26,26.04 48.26,19.05 R5C.1
  Bottom 1.27: T5.G 49.53,13.97 R5C.1
N$16  (via drill 0.6)
  Top 0.305: U1.DIO2/SPISEL3 84.11,84.11 83.82,83.82 v83.82,82.55
  Bottom 0.305: JP2.3 62.87,78.11 63.5,78.74 82.55,78.74 83.82,80.01 v83.82,82.55
N$17
  Bottom 0.61: L2.K 76.2,36.83 OK2.1
N$18
  Top 0.254: OK6.4 35.56,27.3 36.83,26.04 36.83,19.05 R6C.1
  Bottom 1.27: T6.G 38.1,13.97 R6C.1
N$19  (via drill 0.6)
  Top 0.305: v85.72,76.83 85.72,84.31 U1.DIO1/SPISEL2
  Bottom 0.305: JP2.5 60.96,76.2 62.23,74.93 68.58,74.93 69.85,76.2 85.09,76.2 v85.72,76.83
N$20  (via drill 0.6)
  Top 0.305: v87,69.85 87,84.31 U1.DIO0/SPISEL1
  Bottom 0.305: JP2.7 57.78,75.56 58.42,74.93 60.96,74.93 61.59,74.3 61.59,70.48 64.14,67.94 86.36,67.94 87,68.58 v87,69.85
N$21
  Top 0.254: OK7.4 24.13,27.3 25.4,26.04 25.4,19.05 R7C.1
  Bottom 1.27: T7.G 26.67,13.97 R7C.1
N$22
  Bottom 0.61: L5.K 41.91,36.83 OK5.1
N$23  (via drill 0.6)
  Top 0.305: v88.9,69.85 88.9,84.37 U1.SPIMOSI
  Bottom 0.305: JP2.6 60.33,71.12 63.5,65.41 67.31,65.41 71.12,62.23 76.83,62.23 77.47,61.59 88.27,61.59 88.9,62.23 v88.9,69.85
N$24
  Top 0.254: OK8.4 12.7,27.3 13.97,26.04 13.97,19.05 R8C.1
  Bottom 1.27: T8.G 15.24,13.97 R8C.1
N$25
  Bottom 0.61: OK1.6 90.17,36.83 90.17,31.11 93.34,28.57 93.34,26.04 R1B.1
N$26
  Bottom 0.61: OK2.6 78.74,36.83 78.74,31.11 81.92,28.57 81.92,26.04 R2B.1
N$27
  Bottom 0.61: L6.K 30.48,36.83 OK6.1
N$28  (via drill 0.6)
  Top 0.305: v91.44,73.66 92.08,74.3 92.08,84.31 U1.SPICLK
  Bottom 0.305: JP2.2 v91.44,73.66
N$30
  Bottom 0.61: OK3.6 67.31,36.83 67.31,31.11 70.48,28.57 70.48,26.04 R3B.1
N$31
  Bottom 0.61: OK4.6 55.88,36.83 55.88,31.11 59.05,28.57 59.05,26.04 R4B.1
N$32
  Bottom 0.61: L7.K 19.05,36.83 OK7.1
N$33
  Bottom 0.61: OK5.6 44.45,36.83 44.45,31.11 47.62,28.57 47.62,26.04 R5B.1
N$34
  Bottom 0.61: OK6.6 33.02,36.83 33.02,31.11 36.2,28.57 36.2,26.04 R6B.1
N$35
  Bottom 0.61: OK7.6 21.59,36.83 21.59,31.11 24.77,28.57 24.77,26.04 R7B.1
N$36
  Bottom 0.61: OK8.6 10.16,36.83 10.16,31.11 13.34,28.57 13.34,26.04 R8B.1
N$37
  Bottom 0.61: L8.K 7.62,26.04 8.89,27.3 8.89,36.2 8.26,36.83 OK8.1
N$45
  Bottom 0.61: IC3.3 IC3.4 IC3.5
N$46
  Top 0.305: IC3.2 64.14,56.52 62.87,57.78 56.52,57.78 53.98,55.24 IC1.1
  Bottom 0.61: IC3.2 RP2.1
N$47
  Bottom 0.813: R27.2 JP9.2
N$48  (via drill 0.6)
  Top 0.254: IC2.1 v27.3,55.24
  Bottom 0.254: v27.3,55.24 34.29,55.24 38.73,50.8 38.73,48.26 39.37,47.62 69.22,47.62 69.22,53.98
  Bottom 0.61: IC3.1 69.22,53.98 RP3.1
N$49
  Top 0.305: IC3.6 63.5,66.67 62.87,67.31 62.87,70.48 63.5,71.12 75.56,71.12 76.2,73.03 77.56,73.03 U1.DIO11/TIM1GT
N$53
  Bottom 0.61: R2A.2 78.74,26.67 L2.A
N$54
  Bottom 0.61: R3A.2 67.31,26.67 L3.A
N$55
  Bottom 0.61: R4A.2 55.88,26.67 L4.A
N$56
  Bottom 0.61: R5A.2 44.45,26.67 L5.A
N$57
  Bottom 0.61: R6A.2 33.02,26.67 L6.A
N$58
  Bottom 0.61: R7A.2 21.59,26.67 L7.A
N$59
  Bottom 0.61: R8A.2 10.16,26.67 L8.A
N$60
  Bottom 0.61: R1A.2 90.17,26.67 L1.A
N$62
  Top 0.305: U1.DIO20/RXD1 91.73,64.48 BOX_ID.5
N$65
  Bottom 0.813: JP9.1 LED_P.A
N$67
  Top 0.305: ICSP.2 76.2,80.01 76.86,80.01 77.3,79.58 U1.DIO6/TXD0
N$70  (via drill 0.6)
  Top 0.305: PGM.1 79.1,91.72 83.82,87 89.53,87 90.17,86.36 90.17,84.95 U1.SPIMISO 90.17,84.37 v90.17,71.12
  Bottom 0.305: JP2.4 62.87,73.03 64.77,71.12 v90.17,71.12
N$73
  Top 0.305: ICSP.1 76.2,82.55 76.83,82.55 77.26,82.12 U1.DIO4/CTS0
N$74
  Top 0.305: ICSP.5 71.12,72.39 69.85,73.66 69.85,80.01 71.12,81.28 76.2,81.28 76.74,81.28 77.18,80.85 U1.DIO5/RTS0
N$77
  Top 0.305: ICSP.3 73.03,77.47 74.3,78.74 76.2,78.74 76.89,78.74 77.32,78.31 U1.DIO7/RXD0
N$78
  Bottom 1.27: 92.71,6.2 X1.2 arc45 92.71,6.47 92.71,8.89 90.54,11.06 arc-45 90.17,11.96 T1.A2 90.17,17.78 R1B.2
N$79
  Bottom 1.27: X2.2 arc45 82.55,6.08 82.55,7.62 79.11,11.06 arc-45 78.74,11.96 T2.A2 78.74,17.78 R2B.2
N$80
  Bottom 1.27: X3.2 arc-45 72.39,6.3 72.39,7.62 67.68,12.33 arc-45 67.31,13.23 T3.A2 67.31,17.78 R3B.2
N$81
  Bottom 1.27: X4.2 56.25,12.26 arc-45 55.88,13.16 T4.A2 55.88,17.78 R4B.2
N$82
  Bottom 1.27: X5.2 52.44,6.07 arc-45 52.07,6.97 52.07,7.62 49.9,9.79 arc45 49,10.16 45.72,10.16 44.82,11.06 arc-45 44.45,11.96 T5.A2 44.45,17.78 R5B.2
N$83
  Bottom 1.27: X6.2 42.28,6.23 arc-45 41.91,7.13 40.64,8.89 39.74,9.79 arc45 38.84,10.16 34.29,10.16 33.39,11.06 arc-45 33.02,11.96 T6.A2 33.02,17.78 R6B.2
N$84
  Bottom 1.27: X7.2 28.73,9.79 arc45 27.83,10.16 22.86,10.16 21.96,11.06 arc-45 21.59,11.96 T7.A2 21.59,17.78 R7B.2
N$92
  Top 0.305: U1.DIO19/TXD1 90.46,64.54 93.97,61.02 BOX_ID.6
N$93
  Bottom 1.27: X8.2 18.73,9.79 arc45 17.83,10.16 11.43,10.16 10.53,11.06 arc-45 10.16,11.96 T8.A2 10.16,17.78 R8B.2
N$94
  Top 0.305: U1.DIO18/RTS1 89.19,64.38 91.45,62.13 BOX_ID.7
N$95
  Top 0.305: U1.DIO17/CTS1 87.92,64.35 88.91,63.36 BOX_ID.8
N$96
  Top 0.305: JP7.2 74.93,66.04 75.56,66.67 80.28,66.67 U1.DIO12/TIM1_CAP
N$97
  Bottom 0.305: LP.A R5.2
N$98
  Top 0.305: U1.DIO13/TIM1_OUT 81.57,65.33 75.92,59.67 74.95,59.67 JP8.2
N$100  (via drill 0.6)
  Top 0.305: v80.64,82.55 80.64,75.56 79.38,74.3 77.97,74.3 U1.DIO10/TIM0_OUT
  Bottom 0.305: LP.K 90.17,91.44 88.9,90.17 83.82,90.17 82.55,88.9 77.47,88.9 76.83,88.27 76.83,85.72 80.64,83.19 v80.64,82.55
N$101
  Bottom 0.305: LC.A R6.2
N$103  (via drill 0.6)
  Top 0.305: v79.38,82.55 79.38,76.2 78.74,75.56 77.97,75.56 U1.DIO9/TIM0_CAP
  Bottom 0.305: LC.K 82.55,91.44 81.28,90.17 76.2,90.17 75.56,89.53 75.56,85.09 v79.38,82.55
NEUTRE
  pour Bottom (isolate 1.27): 10.12,8.87 94.96,8.88 94.87,2.13 10.14,2.13
O0  (via drill 0.6)
  Top 0.305: v55.88,72.39 55.88,71.75 53.98,69.85 53.98,59.69 53.34,59.05 IC1.4
  Bottom 0.305: LSB.16 55.24,81.28 55.88,80.64 v55.88,72.39 55.88,52.7 57.78,50.8 PA.9
O1  (via drill 0.6)
  Top 0.305: v54.61,72.39 54.61,71.75 53.34,70.48 53.34,60.96 52.7,60.33 IC1.5
  Bottom 0.305: LSB.14 52.7,81.28 53.34,80.64 53.34,77.47 54.61,76.2 v54.61,72.39 54.61,52.7 55.24,52.07 PA.8
O2  (via drill 0.6)
  Top 0.305: v53.34,72.39 53.34,71.75 52.7,71.12 52.7,62.23 52.07,61.59 IC1.6
  Bottom 0.305: LSB.12 50.16,81.28 50.8,80.64 50.8,78.11 53.34,75.56 v53.34,72.39 53.34,52.7 52.7,52.07 PA.7
O3  (via drill 0.6)
  Top 0.305: v52.07,72.39 52.07,63.5 51.44,62.87 IC1.7
  Bottom 0.305: LSB.10 47.62,81.28 48.26,80.64 48.26,78.11 48.9,77.47 50.16,77.47 52.07,75.56 v52.07,72.39 52.07,53.98 50.16,52.07 PA.6
O4  (via drill 0.6)
  Top 0.305: v50.8,72.39 51.44,71.75 51.44,64.77 50.8,64.14 IC1.8
  Bottom 0.305: LSB.8 45.09,81.28 45.72,80.64 45.72,78.11 46.99,76.83 49.53,76.83 50.8,75.56 v50.8,72.39 50.8,55.24 47.62,52.07 PA.5
O5  (via drill 0.6)
  Top 0.305: v49.53,72.39 50.8,71.12 50.8,66.04 50.16,65.41 IC1.9
  Bottom 0.305: LSB.6 42.55,81.28 43.18,80.64 43.18,76.83 43.81,76.2 48.9,76.2 49.53,75.56 v49.53,72.39 49.53,56.52 45.09,52.07 PA.4
O6  (via drill 0.6)
  Top 0.305: v48.26,72.39 50.16,70.48 50.16,67.31 49.53,66.67 IC1.10
  Bottom 0.305: LSB.4 40.01,81.28 40.64,80.64 40.64,76.2 41.27,75.56 47.62,75.56 48.26,74.93 v48.26,72.39 48.26,57.78 42.55,52.07 PA.3
O7  (via drill 0.6)
  Top 0.305: v46.99,72.39 49.53,69.85 49.53,68.58 48.9,67.94 IC1.11
  Bottom 0.305: LSB.2 37.47,81.28 38.1,80.64 38.1,76.2 39.37,74.93 46.35,74.93 46.99,74.3 v46.99,72.39 46.99,59.05 40.01,52.07 PA.2
O8  (via drill 0.6)
  Top 0.305: v29.21,72.39 29.21,71.75 27.3,69.85 27.3,59.69 26.67,59.05 IC2.4
  Bottom 0.305: v29.21,72.39 29.21,80.64 28.57,81.28 MSB.16
O9  (via drill 0.6)
  Top 0.305: v27.94,72.39 27.94,71.75 26.67,70.48 26.67,60.96 26.04,60.33 IC2.5
  Bottom 0.305: v27.94,72.39 26.67,77.47 26.67,80.64 26.04,81.28 MSB.14
O10  (via drill 0.6)
  Top 0.305: v26.67,72.39 26.67,71.75 26.04,71.12 26.04,62.23 25.4,61.59 IC2.6
  Bottom 0.305: v26.67,72.39 25.4,74.93 24.13,78.11 24.13,80.64 23.5,81.28 MSB.12
O11  (via drill 0.6)
  Top 0.305: v25.4,72.39 25.4,63.5 24.77,62.87 IC2.7
  Bottom 0.305: v25.4,72.39 21.59,77.47 21.59,80.64 20.95,81.28 MSB.10
O12  (via drill 0.6)
  Top 0.305: v24.13,72.39 24.77,71.75 24.77,64.77 24.13,64.14 IC2.8
  Bottom 0.254: 19.05,80.64 18.41,81.28
  Bottom 0.305: v24.13,72.39 19.05,77.47 19.05,80.64 | 18.41,81.28 MSB.8
O13  (via drill 0.6)
  Top 0.305: v22.86,72.39 24.13,71.12 24.13,66.04 23.5,65.41 IC2.9
  Bottom 0.305: v22.86,72.39 21.59,73.66 16.51,77.47 16.51,80.64 15.88,81.28 MSB.6
O14  (via drill 0.6)
  Top 0.305: v21.59,72.39 23.5,70.48 23.5,67.31 22.86,66.67 IC2.10
  Bottom 0.305: v21.59,72.39 20.32,73.66 13.97,77.47 13.97,80.64 13.34,81.28 MSB.4
O15  (via drill 0.6)
  Top 0.305: v20.32,72.39 22.86,69.85 22.86,68.58 22.23,67.94 IC2.11
  Bottom 0.305: v20.32,72.39 12.06,72.39 11.43,73.03 11.43,80.64 10.79,81.28 MSB.2
PHASE
  Top 1.27: R8C.2 15.24,22.86 19.05,19.05 T7.A1 | R7C.2 26.67,22.86 30.48,19.05 T6.A1 | R6C.2 38.1,22.86 41.91,19.05 T5.A1 | R5C.2 49.53,22.86 53.34,19.05 T4.A1 | R4C.2 60.96,22.86 64.77,19.05 T3.A1 | R3C.2 72.39,22.86 76.2,19.05 T2.A1 | R2C.2 83.82,22.86 87.63,19.05 T1.A1 87.63,11.43 88.27,10.79 97.16,10.79 97.79,11.43 97.79,20.32 95.25,22.86 R1C.2
  pour Top (isolate 1.27): 5,3 5,17 95,17 95,10 10,10 10,3
SI0  (via drill 0.6)
  Top 0.305: U1.DIO15/SIF_D 85.38,63.84 SI0.1 86.36,60.96 RP0.2 | IC2.23 13.34,56.52 13.97,55.88 13.97,53.34 15.24,52.07 27.3,52.07 31.75,56.52 IC1.23 41.27,56.52 42.55,55.24 42.55,53.98 43.81,52.7 67.31,52.7 70.48,49.53 76.83,49.53 77.47,50.16 v77.47,50.8
  Bottom 0.305: v77.47,50.8 77.47,57.78 78.11,58.42 85.09,58.42 85.72,59.05 RP0.2
SI1  (via drill 0.6)
  Top 0.305: IC2.22 13.97,57.78 15.24,56.52 15.24,54.61 16.51,53.34 26.67,53.34 31.11,57.78 IC1.22 41.91,57.78 43.18,56.52 43.18,54.61 44.45,53.34 53.98,53.34 55.88,55.24 67.31,55.24 67.94,54.61 67.94,53.34 70.48,50.8 v76.2,50.8 | U1.DIO14/SIF_CLK 84.11,63.79 SI1.1 RP1.2
  Bottom 0.305: v76.2,50.8 76.83,51.44 76.83,59.69 77.47,60.33 RP1.2

### Text on the board
tPlace: 9 a 12 v ~ | GND | +3.3v | D0 | D0 | +3.3v | BARREAU Pascal | Carte Puissance